# Altium schematic sheet Power.SchDoc
size A4
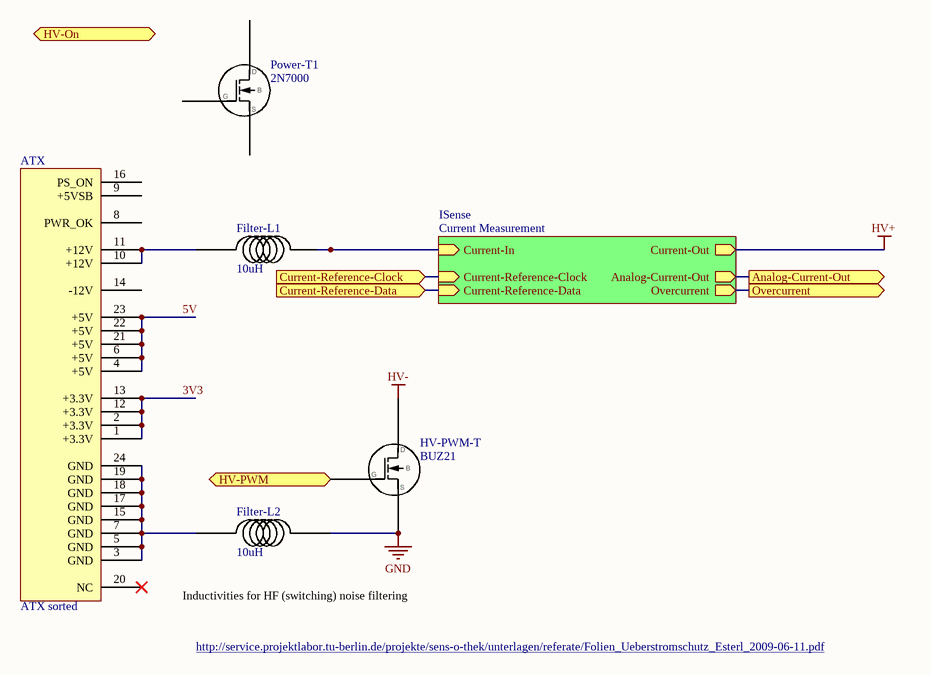
[diagram p0: Power.SchDoc]

## Parts
ATX  ATX sorted  [ATX]
Filter-L1  10uH  [Header 1x2+1 1.0mm]
Filter-L2  10uH  [Header 1x2+1 1.0mm]
HV-PWM-T  BUZ21
Power-T1  2N7000  [SOT-23-3]

## Sub-sheets
ISense = Current Measurement: Current-Out (out), Overcurrent (out), Current-In (in), Current-Reference-Clock (in), Current-Reference-Data (in), Analog-Current-Out (out)

## Ports
Analog-Current-Out (out), Current-Reference-Clock (in), Current-Reference-Data (in), HV-On (in), HV-PWM (in), Overcurrent (out)

## Nets
GND: Filter-L2.2 HV-PWM-T.S
HV+: sheet ISense/Current-Out
HV-: HV-PWM-T.D
3V3: ATX.1(+3.3V) ATX.2(+3.3V) ATX.12(+3.3V) ATX.13(+3.3V)
5V: ATX.4(+5V) ATX.6(+5V) ATX.21(+5V) ATX.22(+5V) ATX.23(+5V)
Analog-Current-Out: port Analog-Current-Out, sheet ISense/Analog-Current-Out
Current-Reference-Clock: port Current-Reference-Clock, sheet ISense/Current-Reference-Clock
Current-Reference-Data: port Current-Reference-Data, sheet ISense/Current-Reference-Data
HV-PWM: HV-PWM-T.G ; port HV-PWM
Overcurrent: port Overcurrent, sheet ISense/Overcurrent
NetATX_3: ATX.3(GND) ATX.5(GND) ATX.7(GND) ATX.15(GND) ATX.17(GND) ATX.18(GND) ATX.19(GND) ATX.24(GND) Filter-L2.1
NetATX_10: ATX.10(+12V) ATX.11(+12V) Filter-L1.1
NetFilter-L1_2: Filter-L1.2 ; sheet ISense/Current-In

Not connected (* = marked no-connect by the designer): ATX 8(PWR_OK) 9(+5VSB) 14(-12V) 16(PS_ON) 20(NC)*; Power-T1 1 2 3

## Notes on the sheet
- Inductivities for HF (switching) noise filtering
- http://service.projektlabor.tu-berlin.de/projekte/sens-o-thek/unterlagen/referate/Folien_Ueberstromschutz_Esterl_2009-06-11.pdf

## Library data of the parts
Filter-L1 Filter-L2 = Coil
HV-PWM-T = FET N-Channel: Enhancement Type
Power-T1 = 2N7000: N-FET